# Altium schematic sheet MAIN.SchDoc
size A3; DocumentNumber: 1; SheetNumber: 1; SheetTotal: 2
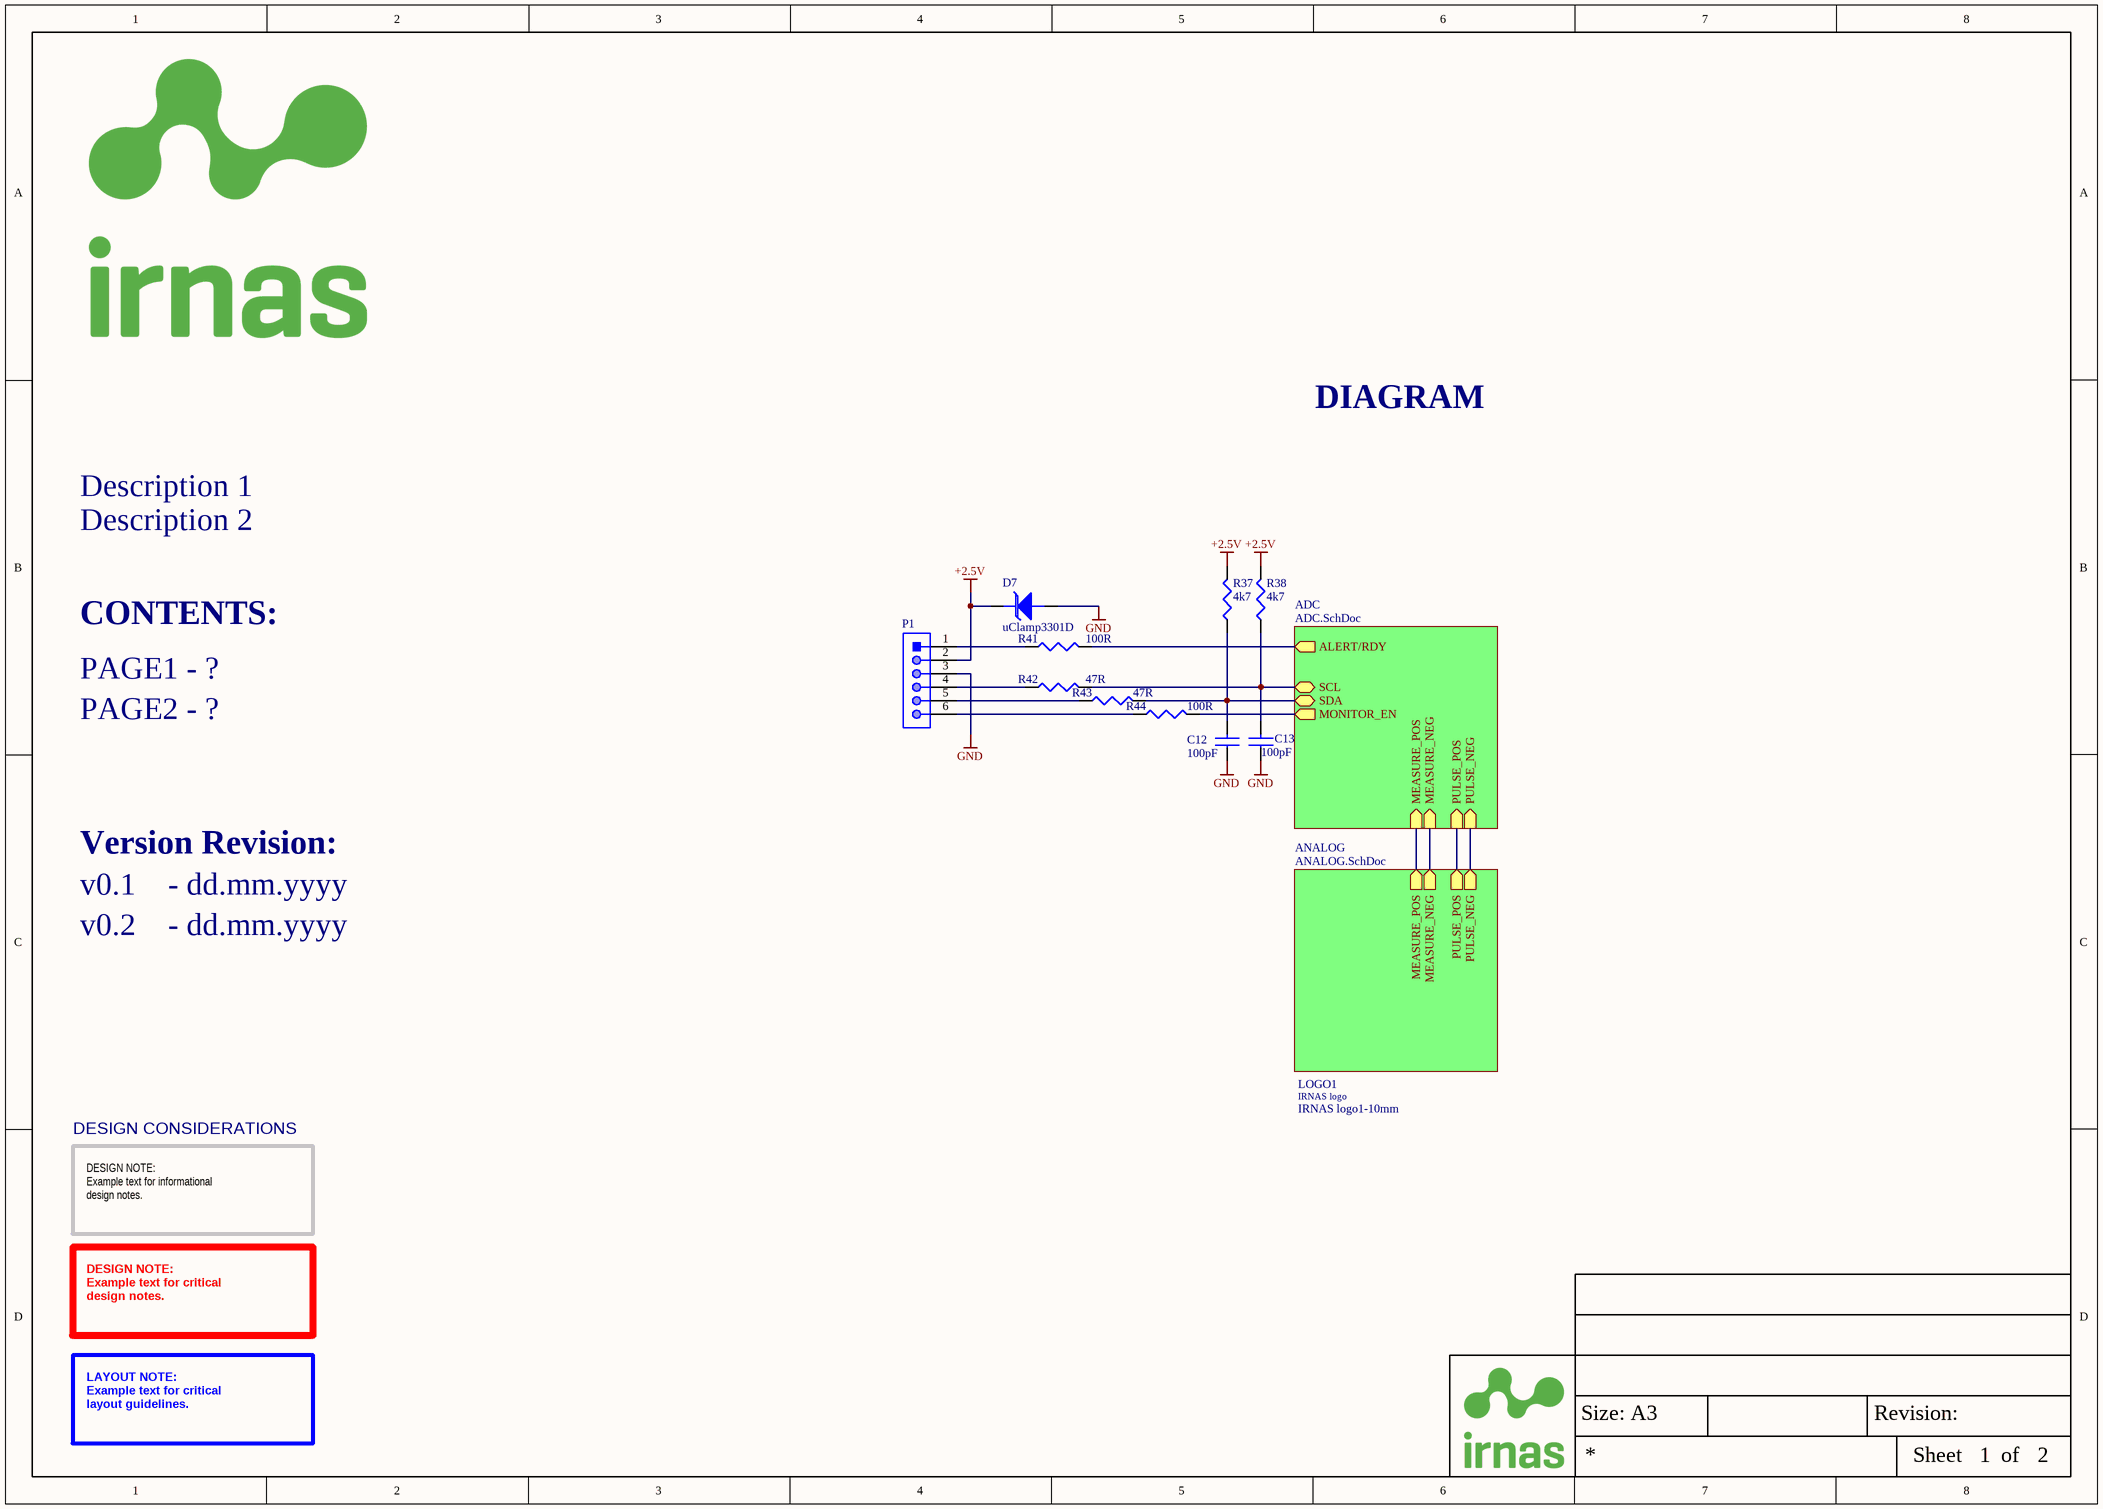
[diagram p0: MAIN.SchDoc]

## Parts
C12  100pF  [CAP0402]
C13  100pF  [CAP0402]
D7  uClamp3301D  [SOD-323]
LOGO1  IRNAS logo1-10mm  [LOGO_1-10MM]
P1  IRNAS - LION_EXTENSION  [IRNAL_LION_ADDON]  (value not drawn)  (no BOM)
R37  4k7  [RES0402]
R38  4k7  [RES0402]
R41  100R  [RES0402]
R42  47R  [RES0402]
R43  47R  [RES0402]
R44  100R  [RES0402]

## Sub-sheets
ADC = ADC.SchDoc: SCL (bidir), MONITOR_EN (out), PULSE_NEG (in), PULSE_POS (in), MEASURE_NEG (in), ALERT/RDY (out), MEASURE_POS (in), SDA (bidir)
ANALOG = ANALOG.SchDoc: MEASURE_NEG (out), MEASURE_POS (out), PULSE_NEG (out), PULSE_POS (out)

## Nets
+2.5V: D7.K(cathode) P1.2 R37.2 R38.2
GND: C12.1 C13.1 D7.A(ANODE) P1.3
NetC12_2: C12.2 R37.1 R43.2 ; sheet ADC/SDA
NetC13_2: C13.2 R38.1 R42.2 ; sheet ADC/SCL
NetP1_1: P1.1 R41.1
NetP1_4: P1.4 R42.1
NetP1_5: P1.5 R43.1
NetP1_6: P1.6 R44.1
NetR41_2: R41.2 ; sheet ADC/ALERT/RDY
NetR44_2: R44.2 ; sheet ADC/MONITOR_EN
(unnamed): sheet ADC/PULSE_NEG, sheet ANALOG/PULSE_NEG
(unnamed): sheet ADC/PULSE_POS, sheet ANALOG/PULSE_POS
(unnamed): sheet ADC/MEASURE_NEG, sheet ANALOG/MEASURE_NEG
(unnamed): sheet ADC/MEASURE_POS, sheet ANALOG/MEASURE_POS

## Notes on the sheet
- DIAGRAM
- Description 1
- Description 2
- CONTENTS:
- PAGE1 - ?
- PAGE2 - ?
- Version Revision:
- v0.1    - dd.mm.yyyy
- v0.2    - dd.mm.yyyy
- DESIGN CONSIDERATIONS
- DESIGN NOTE:
  Example text for informational
  design notes.
- DESIGN NOTE:
  Example text for critical
  design notes.
- LAYOUT NOTE:
  Example text for critical
  layout guidelines.
- Size: A3
- Revision:
- Sheet
- of
- (in symbol IRNAS logo1-10mm) IRNAS logo

## Library data of the parts
C12 C13 = C - 100pF/0402: Cap Ceramic 100pF 50V X7R 10% SMD 0402 125C T/R; Manufacturer: KEMET; Manufacturer Part Number: C0402C101K5RACTU; IRNAS Part No.: /; Stock 1: 35279; Pricing 1: 10=0.0252, 100=0.0202, 500=0.0126, 2500=0.0084, 5000=0.0072 (EUR); Mount: Surface Mount; Case/Package: 0402; Case Code (Imperial): 0402; Case Code (Metric): 1005; Dielectric Material: Ceramic; Min Operating Temperature: -55°C; Max Operating Temperature: 125°C; Packaging: Tape and Reel; Package Quantity: 10000; Capacitance: 100pF; Voltage Rating: 50V; Voltage Rating (DC): 50V; Tolerance: 10%; Dielectric: X7R; Termination: SMD/SMT; Length: 1mm; Width: 0.5mm; Thickness: 0.02inch; Depth: 0.5mm; REACH SVHC: No SVHC; ComponentLink1URL: http://components.arrow.com/part/dataview/48781706S8928725N7429; ComponentLink1Description: http://components.arrow.com/part/dataview/48781706S8928725N7429; ComponentLink2URL: http://www.farnell.com/datasheets/2112152.pdf; ComponentLink2Description: http://www.farnell.com/datasheets/2112152.pdf; ComponentLink3URL: http://www.mouser.com/ds/2/212/KEM_C1002_X7R_SMD-1102033.pdf; ComponentLink3Description: http://www.mouser.com/ds/2/212/KEM_C1002_X7R_SMD-1102033.pdf; Supplier 1: Farnell; Supplier Part Number 1: 1758984
D7 = D_TVS - uClamp3301D: TVS Diode, µClamp Series, Unidirectional, 3.3 V, 9.5 V; Manufacturer: DIODES INC.; Manufacturer Part Number: 1N4148W-7-F.; Diode Configuration: Single; Repetitive Reverse Voltage Vrrm Max: 100; Forward Current If(AV): 300; Forward Voltage VF Max: 1.25; Reverse Recovery Time trr Max: 4; Forward Surge Current Ifsm Max: 2; Diode Case Style: SOD-123; Product Range: 1N4148 Series; SVHC: No SVHC (17-Dec-2015); Diode Type: Switching; RoHS: YES; Stock 1: 157320; Pricing 1: 1=0.136, 25=0.132, 100=0.0465, 500=0.042, 1000=0.024, 3000=0.021, 9000=0.017, 30000=0.0149 (GBP); Operating Temperature Max: 150; No. of Pins: 2; Packaging: Cut Tape; Automotive Qualification Standard: -; MSL: MSL 1 - Unlimited; Operating Temperature Min: -65; Operating Temperature Range: -65°C to +150°C<!--FANDB--><div class="features-and-benefits-container"><div class="features-and-benefits-description"><span class="features-benefits-value">The 1N4148W-7-F is a surface mount fast Switching Diode with moulded plastic case. Suitable for general purpose switching applications.</span></div><div class="features-and-benefits-list"><ul class="features-and-benefits-list-list"><li class="features-and-benefits-list-item">Fast Switching Speed</li><li class="features-and-benefits-list-item">2; ComponentLink1URL: https://semtech.my.salesforce.com/sfc/p/#E0000000JelG/a/44000000MCod/Fs.eSBQs1U.304Nkc5rxRZ3Lk6_1A4.ZX_npjU1R.C8; ComponentLink1Description: Datasheet; Supplier 1: Farnell; Supplier Part Number 1: 1456422
P1 = IRNAS - LION_EXTENSION: LION_EXTENSION; ComponentLink1Description: Manufacturer; ComponentLink1URL: http://www.we-online.de; ComponentLink2Description: Datasheet; ComponentLink2URL: http://katalog.we-online.de/em/datasheet/691305130004.pdf
R37 R38 = R - 4k7/0402: 4.7 kohm, MCWR Series, 50 V; Manufacturer: MULTICOMP; Manufacturer Part Number: MCMR06X4701FTL; IRNAS Part No.: I-100003; Resistance: 4.7; Voltage Rating: 75; Resistor Case Style: 0603 [1608 Metric]; Power Rating: 100; Resistance Tolerance: ± 1%; Product Range: MCMR Series; Resistor Element Material: Ceramic; Temperature Coefficient: ± 100; SVHC: No SVHC (12-Jan-2017)<!--FANDB--><div class="features-and-benefits-container"><div class="features-and-benefits-description"><span class="features-benefits-value">The Multicomp MCMR series resistors are automotive grade, anti sulphured thick film chip resistor. The resistance range includes E24 and E96 decade values from 1ohm to 10Mohm. These resistors are constructed on top of a high grade ceramic body.</span></div><div class="features-and-benefits-list"><ul class="features-and-benefits-list-list"><li class="features-and-benefits-list-item">EIA 0402, 0603, 0805, 1206 chip sizes available</li><li class="features-and-benefits-list-item">High reliability and stability</li><li class="features-and-benefits-list-item">Automotive grade AEC-Q200 compliant</li><li class="features-and-benefits-list-item">Complaint with (IEC 60068-1) 55/155/56 climatic category</li><li class="features-and-benefits-list-item">Maximum operation voltage of 50V, 75V, 150V and 200V</li><li class="features-and-benefits-list-item">Power rating of 62.5mW, 100mW, 125mW and 250mW</li><li class="features-and-benefits-list-item">Available in ±1% and ±5% tolerance</li><li class="features-and-benefits-list-item">Temperature coefficient (TCR) of +200ppm/°C, +100ppm/°C and -200ppm/°C to +400ppm/°C</li><li class="features-and-benefits-list-item">Operating temperature range -55°C to 155; RoHS: Y-EX; Stock 1: 218618; Pricing 1: 10=0.0085, 100=0.0051, 500=0.0036, 1000=0.0028, 2500=0.0023 (GBP); Packaging: Cut Tape; Automotive Qualification Standard: -; ComponentLink1URL: http://www.farnell.com/datasheets/2860681.pdf?_ga=2.106290502.431277253.1573729600-1373726713.1554121096&_gac=1.180096854.1571402529.CjwKCAjwxaXtBRBbEiwAPqPxcCedmxiKa04iNyErqeZ3YE_megEuFQhz7mFuJRxR0uEYBmhYeHxt1xoC4MkQAvD_BwE; ComponentLink1Description: Datasheet; Supplier 1: Farnell; Supplier Part Number 1: 2447187
R41 R44 = R - 100R/0402: MULTICOMP         MCMR04X1000FTL            SMD Chip Resistor, Ceramic, MCMR Series, 100 ohm, 50 V, 0402 [1005 Metric], 62.5 mW,  1%; IRNAS Part No.: /; Temperature Coefficient: 100ppm/°C; Power Rating: 62.5mW; Voltage Rating: 50V; Supplier 1: Farnell; Manufacturer: Multicomp; Manufacturer Part Number: MCMR04X1000FTL; Stock 1: 62365; Pricing 1: 10=0.0071, 100=0.0042, 500=0.003, 2500=0.0024, 5000=0.0019 (GBP); Case/Package: 0402; Case Code (Metric): 1005; Case Code (Imperial): 0402; Resistance: 100R; Tolerance: 1%; Composition: Ceramic; Packaging: Cut Tape; Voltage Rating (DC): 50V; REACH SVHC: No SVHC; ComponentLink1URL: https://datasheet.ciiva.com/28692/1716705-28692087.pdf; ComponentLink1Description: https://datasheet.ciiva.com/28692/1716705-28692087.pdf; ComponentLink2URL: https://datasheet.ciiva.com/22708/1716705-22708156.pdf; ComponentLink2Description: https://datasheet.ciiva.com/22708/1716705-22708156.pdf; Supplier Part Number 1: 2072515
R42 R43 = R - 47R/0402: MULTICOMP - MCMR06X4702FTL - RES, CERAMIC, 47R, 1%, 0.1W, 0402; Resistance: 47; Voltage Rating: 75; Resistor Case Style: 0603 [1608 Metric]; Power Rating: 100; Product Range: MCMR Series; Temperature Coefficient: ± 100; Automotive Qualification Standard: -<!--FANDB--><div class="features-and-benefits-container"><div class="features-and-benefits-description"><span class="features-benefits-value">The Multicomp MCMR series resistors are automotive grade, anti sulphured thick film chip resistor. The resistance range includes E24 and E96 decade values from 1ohm to 10Mohm. These resistors are constructed on top of a high grade ceramic body.</span></div><div class="features-and-benefits-list"><ul class="features-and-benefits-list-list"><li class="features-and-benefits-list-item">EIA 0402, 0603, 0805, 1206 chip sizes available</li><li class="features-and-benefits-list-item">High reliability and stability</li><li class="features-and-benefits-list-item">Automotive grade AEC-Q200 compliant</li><li class="features-and-benefits-list-item">Complaint with (IEC 60068-1) 55/155/56 climatic category</li><li class="features-and-benefits-list-item">Maximum operation voltage of 50V, 75V, 150V and 200V</li><li class="features-and-benefits-list-item">Power rating of 62.5mW, 100mW, 125mW and 250mW</li><li class="features-and-benefits-list-item">Available in ±1% and ±5% tolerance</li><li class="features-and-benefits-list-item">Temperature coefficient (TCR) of +200ppm/°C, +100ppm/°C and -200ppm/°C to +400ppm/°C</li><li class="features-and-benefits-list-item">Operating temperature range -55°C to 155; Manufacturer: MULTICOMP; Manufacturer Part Number: MCMR06X4702FTL; RoHS: Y-EX; Stock 1: 21427; Pricing 1: 10=0.0115, 100=0.009, 500=0.0064, 1000=0.0051, 2500=0.0042, 5000=0.0032, 25000=0.0021, 50000=0.0017 (GBP); Resistance Tolerance: ± 1%; Packaging: Cut Tape; Resistor Element Material: Ceramic; Supplier 1: Farnell; Supplier Part Number 1: 1469719